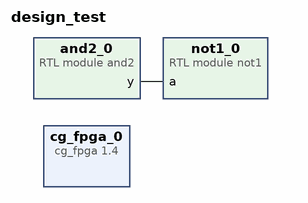
[diagram p0: block diagram of the top level]
# Vivado block design design_test, xc7z020clg400-1, Vivado 2024.2
create_bd_design design_test

create_bd_cell -type ip -vlnv educg.net:user:cg_fpga:1.4 cg_fpga_0
create_bd_cell -type module -reference and2 and2_0
create_bd_cell -type module -reference not1 not1_0

# ---- connections ----

connect_bd_net [get_bd_pins and2_0/y] [get_bd_pins not1_0/a]

validate_bd_design
save_bd_design
